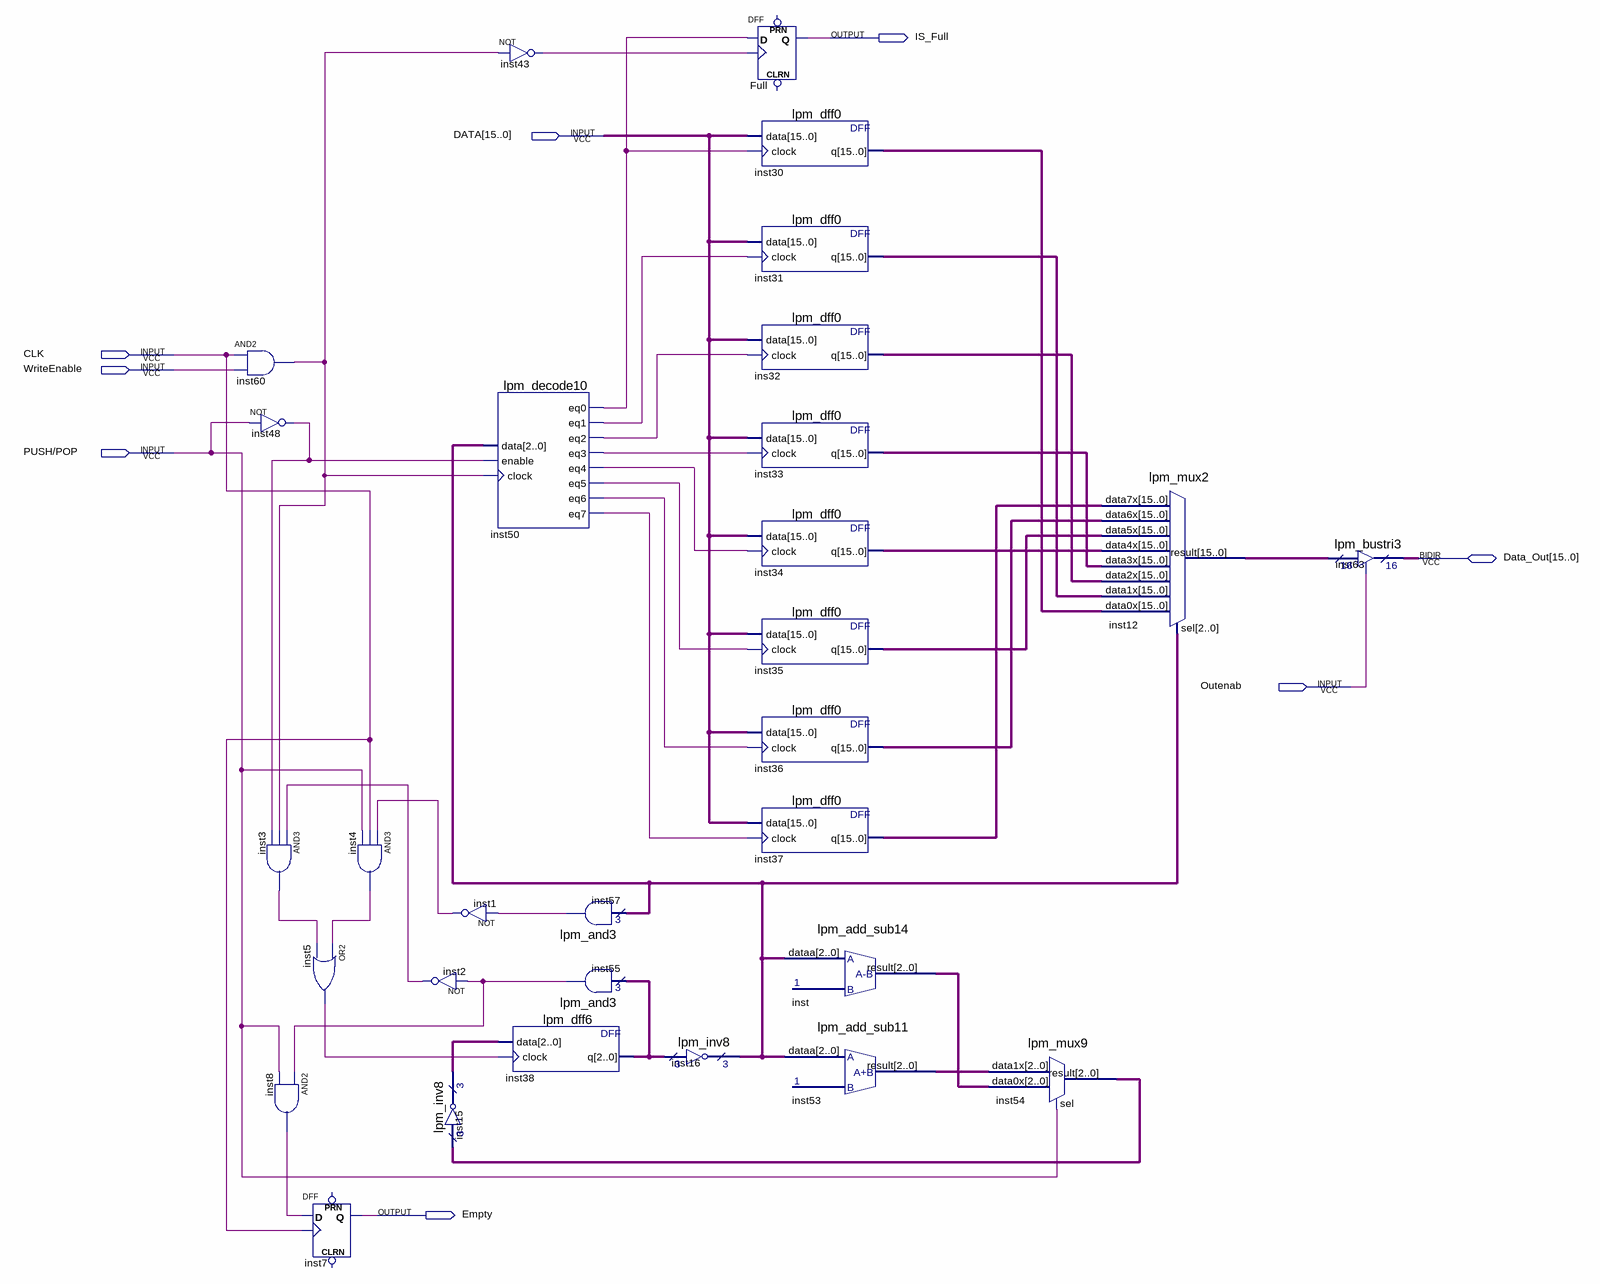
[diagram p0: schematic sheet]
// Quartus schematic Stack.bdf as structural Verilog: 30 symbols, 8 pins
module Stack (
  input  [15:0] DATA,
  input  CLK,
  input  WriteEnable,
  input  \PUSH/POP ,
  input  Outenab,
  inout  [15:0] Data_Out,
  output IS_Full,
  output Empty
);

  wire inst1_out, inst2_out, inst3_out, inst4_out, inst5_out, inst8_out, inst43_out, inst48_out, inst50_eq0,
       inst50_eq1, inst50_eq2, inst50_eq3, inst50_eq4, inst50_eq5, inst50_eq6, inst50_eq7, inst55_result,
       inst57_result, inst60_out;
  wire [2:0] inst15_result, inst16_result, inst38_q, inst53_result, inst54_result, inst_result;
  wire [15:0] ins32_q, inst12_result, inst30_q, inst31_q, inst33_q, inst34_q, inst35_q, inst36_q, inst37_q;

  and inst60 (inst60_out, CLK, WriteEnable);
  not inst48 (inst48_out, \PUSH/POP );
  and inst3 (inst3_out, inst2_out, inst60_out, inst48_out);
  and inst8 (inst8_out, inst55_result, \PUSH/POP );
  or inst5 (inst5_out, inst4_out, inst3_out);
  DFF inst7 (.CLK(CLK), .D(inst8_out), .Q(Empty));  // open: CLRN, PRN
  and inst4 (inst4_out, inst1_out, CLK, \PUSH/POP );
  not inst2 (inst2_out, inst55_result);
  lpm_inv8 inst15 (.data(inst54_result), .result(inst15_result));
  not inst43 (inst43_out, inst60_out);
  lpm_decode10 inst50 (
    .data(inst16_result), .enable(inst48_out), .clock(inst60_out), .eq0(inst50_eq0), .eq1(inst50_eq1),
    .eq2(inst50_eq2), .eq3(inst50_eq3), .eq4(inst50_eq4), .eq5(inst50_eq5), .eq6(inst50_eq6), .eq7(inst50_eq7));
  not inst1 (inst1_out, inst57_result);
  lpm_dff6 inst38 (.data(inst15_result), .clock(inst5_out), .q(inst38_q));
  lpm_and3 inst57 (.data(inst16_result), .result(inst57_result));
  lpm_and3 inst55 (.data(inst38_q), .result(inst55_result));
  lpm_inv8 inst16 (.data(inst38_q), .result(inst16_result));
  DFF Full (.CLK(inst43_out), .D(inst50_eq0), .Q(IS_Full));  // open: CLRN, PRN
  lpm_dff0 inst30 (.data(DATA), .clock(inst50_eq0), .q(inst30_q));
  lpm_dff0 inst31 (.data(DATA), .clock(inst50_eq1), .q(inst31_q));
  lpm_dff0 ins32 (.data(DATA), .clock(inst50_eq2), .q(ins32_q));
  lpm_dff0 inst33 (.data(DATA), .clock(inst50_eq3), .q(inst33_q));
  lpm_dff0 inst34 (.data(DATA), .clock(inst50_eq4), .q(inst34_q));
  lpm_dff0 inst35 (.data(DATA), .clock(inst50_eq5), .q(inst35_q));
  lpm_dff0 inst36 (.data(DATA), .clock(inst50_eq6), .q(inst36_q));
  lpm_dff0 inst37 (.data(DATA), .clock(inst50_eq7), .q(inst37_q));
  lpm_add_sub14 inst (.dataa(inst16_result), .result(inst_result));
  lpm_add_sub11 inst53 (.dataa(inst16_result), .result(inst53_result));
  lpm_mux9 inst54 (.data1x(inst53_result), .data0x(inst_result), .sel(\PUSH/POP ), .result(inst54_result));
  lpm_mux2 inst12 (
    .data7x(inst37_q), .data6x(inst36_q), .data5x(inst35_q), .data4x(inst34_q), .data3x(inst33_q),
    .data2x(ins32_q), .data1x(inst31_q), .data0x(inst30_q), .sel(inst16_result), .result(inst12_result));
  lpm_bustri3 inst63 (.enabledt(Outenab), .data(inst12_result), .tridata(Data_Out));
endmodule
